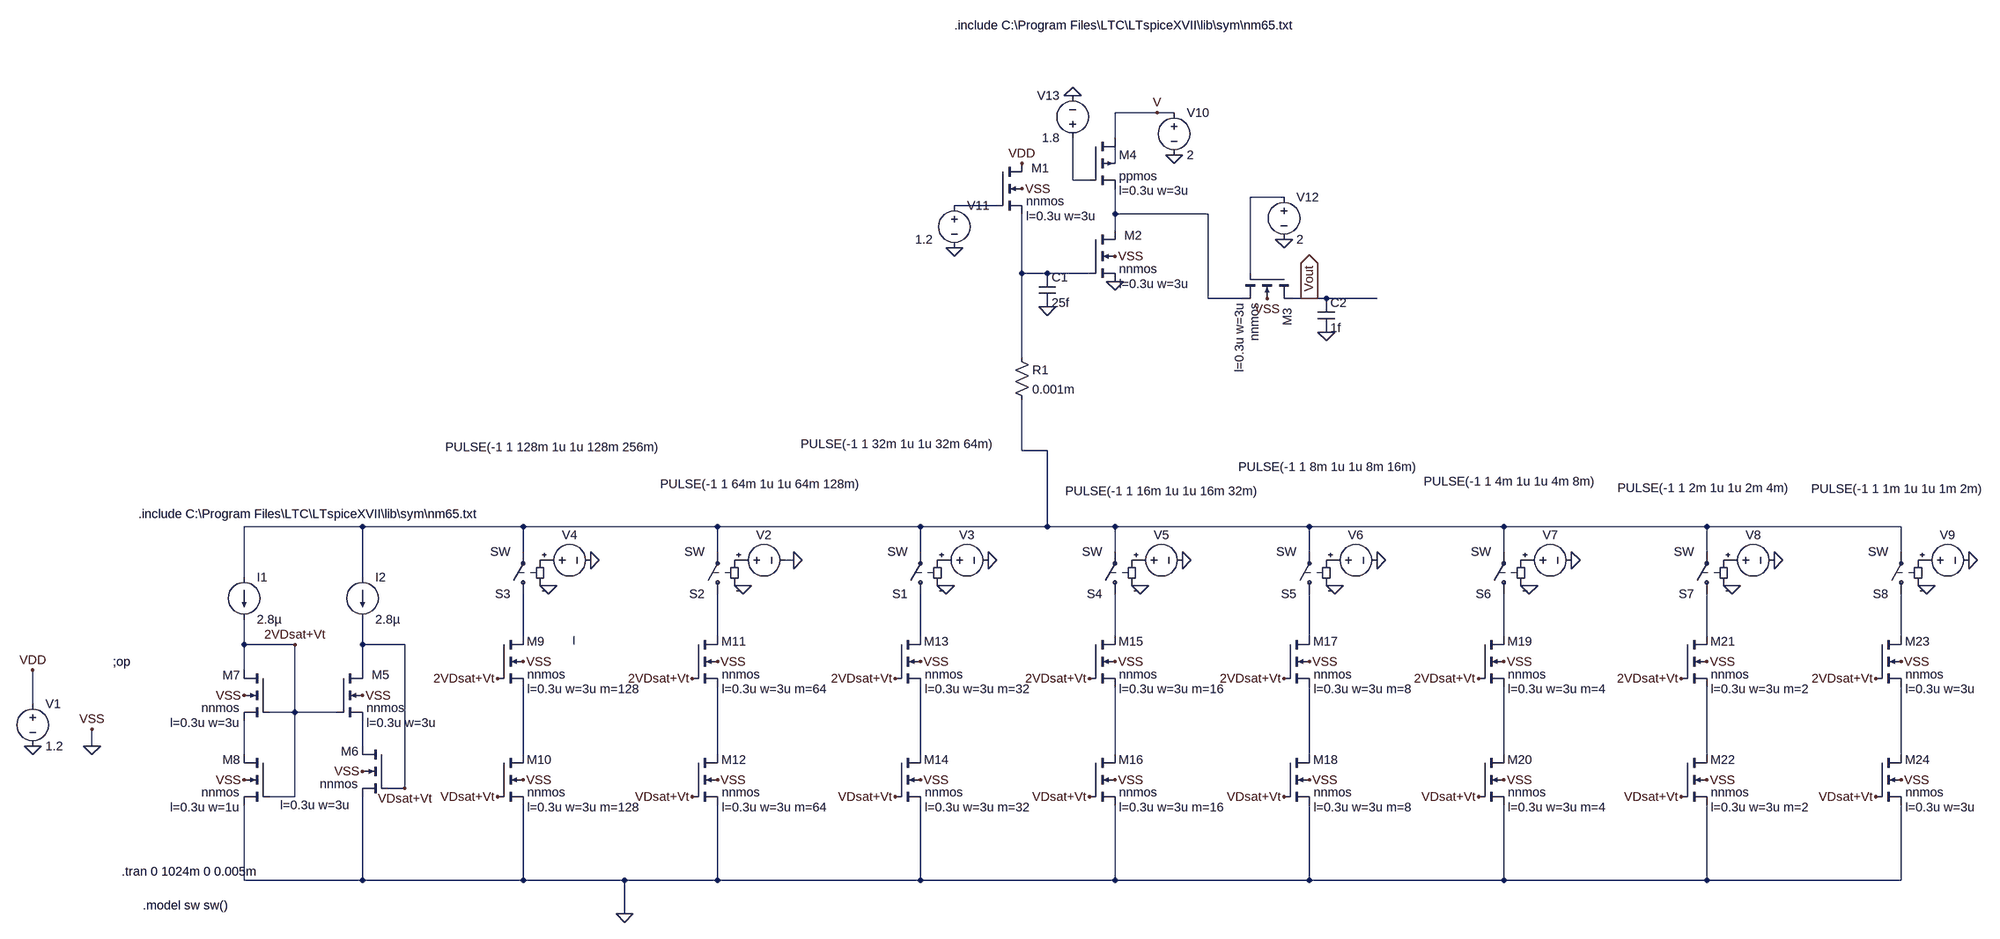
[diagram p0: schematic APS_cell_region_find_with_DAC.asc]
APS_cell_region_find_with_DAC.asc, the LTspice schematic file:
Version 4
SHEET 1 1800 1524
WIRE 224 -64 144 -64
WIRE 256 -64 224 -64
WIRE 144 -16 144 -64
WIRE 144 32 144 0
WIRE 64 64 64 -16
WIRE 96 64 64 64
WIRE 464 96 400 96
WIRE -80 112 -160 112
WIRE 144 128 144 80
WIRE 320 128 144 128
WIRE 144 160 144 128
WIRE -32 240 -32 128
WIRE 16 240 -32 240
WIRE 96 240 16 240
WIRE 400 240 400 96
WIRE 320 288 320 128
WIRE 384 288 320 288
WIRE 512 288 480 288
WIRE 544 288 512 288
WIRE 640 288 544 288
WIRE -32 400 -32 240
WIRE -32 576 -32 480
WIRE 16 576 -32 576
WIRE -1280 720 -1504 720
WIRE -976 720 -1280 720
WIRE -608 720 -976 720
WIRE -224 720 -608 720
WIRE 16 720 16 576
WIRE 16 720 -224 720
WIRE 144 720 16 720
WIRE 512 720 144 720
WIRE 880 720 512 720
WIRE 1264 720 880 720
WIRE 1632 720 1264 720
WIRE -976 768 -976 720
WIRE -608 768 -608 720
WIRE -224 768 -224 720
WIRE 144 768 144 720
WIRE 512 768 512 720
WIRE 880 768 880 720
WIRE 1264 768 1264 720
WIRE 1632 768 1632 720
WIRE -464 784 -480 784
WIRE -1504 816 -1504 720
WIRE -1280 816 -1280 720
WIRE -976 928 -976 848
WIRE -608 928 -608 848
WIRE -224 928 -224 848
WIRE 144 928 144 848
WIRE 512 928 512 848
WIRE 880 928 880 848
WIRE 1264 928 1264 848
WIRE 1632 928 1632 848
WIRE -1504 944 -1504 896
WIRE -1408 944 -1504 944
WIRE -1280 944 -1280 896
WIRE -1200 944 -1280 944
WIRE -880 944 -880 928
WIRE -1504 992 -1504 944
WIRE -1280 992 -1280 944
WIRE -1904 1056 -1904 992
WIRE -1408 1072 -1408 944
WIRE -1408 1072 -1456 1072
WIRE -1328 1072 -1408 1072
WIRE -1792 1136 -1792 1104
WIRE -1280 1136 -1280 1088
WIRE -1504 1152 -1504 1088
WIRE -976 1152 -976 1024
WIRE -608 1152 -608 1024
WIRE -224 1152 -224 1024
WIRE 144 1152 144 1024
WIRE 512 1152 512 1024
WIRE 880 1152 880 1024
WIRE 1264 1152 1264 1024
WIRE 1632 1152 1632 1024
WIRE -1200 1216 -1200 944
WIRE -1200 1216 -1232 1216
WIRE -1408 1232 -1408 1072
WIRE -1408 1232 -1456 1232
WIRE -1504 1440 -1504 1248
WIRE -1280 1440 -1280 1232
WIRE -1280 1440 -1504 1440
WIRE -976 1440 -976 1248
WIRE -976 1440 -1280 1440
WIRE -784 1440 -976 1440
WIRE -608 1440 -608 1248
WIRE -608 1440 -784 1440
WIRE -224 1440 -224 1248
WIRE -224 1440 -608 1440
WIRE 144 1440 144 1248
WIRE 144 1440 -224 1440
WIRE 512 1440 512 1248
WIRE 512 1440 144 1440
WIRE 880 1440 880 1248
WIRE 880 1440 512 1440
WIRE 1264 1440 1264 1248
WIRE 1264 1440 880 1440
WIRE 1632 1440 1632 1248
WIRE 1632 1440 1264 1440
WIRE -784 1504 -784 1440
FLAG -32 80 VSS
FLAG 144 208 VSS
FLAG 432 288 VSS
FLAG 16 304 0
FLAG -1792 1136 0
FLAG -1280 1040 VSS
FLAG -1280 1184 VSS
FLAG -1504 1040 VSS
FLAG -1504 1200 VSS
FLAG -976 976 VSS
FLAG -976 1200 VSS
FLAG -1792 1104 VSS
FLAG -1408 944 2VDsat+Vt
FLAG -1024 1008 2VDsat+Vt
FLAG -1200 1216 VDsat+Vt
FLAG -1904 1136 0
FLAG -1904 992 VDD
FLAG -608 976 VSS
FLAG -608 1200 VSS
FLAG -656 1008 2VDsat+Vt
FLAG -224 976 VSS
FLAG -224 1200 VSS
FLAG -272 1008 2VDsat+Vt
FLAG -656 1232 VDsat+Vt
FLAG -272 1232 VDsat+Vt
FLAG -848 784 0
FLAG -464 784 0
FLAG -96 784 0
FLAG -1024 1232 VDsat+Vt
FLAG -928 832 0
FLAG -560 832 0
FLAG -176 832 0
FLAG 144 976 VSS
FLAG 144 1200 VSS
FLAG 96 1008 2VDsat+Vt
FLAG 96 1232 VDsat+Vt
FLAG 272 784 0
FLAG 192 832 0
FLAG 512 976 VSS
FLAG 512 1200 VSS
FLAG 464 1008 2VDsat+Vt
FLAG 464 1232 VDsat+Vt
FLAG 640 784 0
FLAG 560 832 0
FLAG 880 976 VSS
FLAG 880 1200 VSS
FLAG 832 1008 2VDsat+Vt
FLAG 832 1232 VDsat+Vt
FLAG 1008 784 0
FLAG 928 832 0
FLAG 1264 976 VSS
FLAG 1264 1200 VSS
FLAG 1216 1008 2VDsat+Vt
FLAG 1216 1232 VDsat+Vt
FLAG 1392 784 0
FLAG 1312 832 0
FLAG 1632 976 VSS
FLAG 1632 1200 VSS
FLAG 1584 1008 2VDsat+Vt
FLAG 1584 1232 VDsat+Vt
FLAG 1760 784 0
FLAG 1680 832 0
FLAG -784 1504 0
FLAG 544 352 0
FLAG 512 288 Vout
IOPIN 512 288 Out
FLAG 256 16 0
FLAG 144 256 0
FLAG 224 -64 V
FLAG -32 32 VDD
FLAG -160 192 0
FLAG 464 176 0
FLAG 64 -96 0
SYMBOL nmos4 -80 32 R0
WINDOW 123 56 100 Left 2
WINDOW 0 66 9 Left 2
SYMATTR Value2 l=0.3u w=3u
SYMATTR InstName M1
SYMATTR Value nnmos
SYMBOL nmos4 96 160 R0
WINDOW 123 56 100 Left 2
WINDOW 0 66 9 Left 2
SYMATTR Value2 l=0.3u w=3u
SYMATTR InstName M2
SYMATTR Value nnmos
SYMBOL nmos4 480 240 R90
WINDOW 123 56 100 Left 2
WINDOW 0 66 9 Left 2
SYMATTR Value2 l=0.3u w=3u
SYMATTR InstName M3
SYMATTR Value nnmos
SYMBOL pmos4 96 -16 R0
WINDOW 123 56 100 Left 2
SYMATTR Value2 l=0.3u w=3u
SYMATTR InstName M4
SYMATTR Value ppmos
SYMBOL cap 0 240 R0
SYMATTR InstName C1
SYMATTR Value 25f
SYMBOL nmos4 -1328 992 R0
WINDOW 123 56 100 Left 2
WINDOW 0 66 9 Left 2
SYMATTR Value2 l=0.3u w=3u
SYMATTR InstName M5
SYMATTR Value nnmos
SYMBOL nmos4 -1232 1136 M0
WINDOW 123 72 112 Left 2
WINDOW 0 55 10 Left 2
SYMATTR Value2 l=0.3u w=3u
SYMATTR InstName M6
SYMATTR Value nnmos
SYMBOL nmos4 -1456 992 M0
WINDOW 123 56 100 Left 2
WINDOW 0 55 10 Left 2
SYMATTR Value2 l=0.3u w=3u
SYMATTR InstName M7
SYMATTR Value nnmos
SYMBOL nmos4 -1456 1152 M0
WINDOW 123 56 100 Left 2
WINDOW 0 55 10 Left 2
SYMATTR Value2 l=0.3u w=1u
SYMATTR InstName M8
SYMATTR Value nnmos
SYMBOL nmos4 -1024 928 R0
WINDOW 123 56 100 Left 2
WINDOW 0 55 10 Left 2
SYMATTR Value2 l=0.3u w=3u m=128
SYMATTR InstName M9
SYMATTR Value nnmos
SYMBOL nmos4 -1024 1152 R0
WINDOW 123 56 100 Left 2
WINDOW 0 55 10 Left 2
SYMATTR Value2 l=0.3u w=3u m=128
SYMATTR InstName M10
SYMATTR Value nnmos
SYMBOL current -1504 816 R0
WINDOW 123 0 0 Left 0
WINDOW 39 0 0 Left 0
SYMATTR InstName I1
SYMATTR Value 2.8µ
SYMBOL current -1280 816 R0
WINDOW 123 0 0 Left 0
WINDOW 39 0 0 Left 0
SYMATTR InstName I2
SYMATTR Value 2.8µ
SYMBOL voltage -1904 1040 R0
WINDOW 123 0 0 Left 0
WINDOW 39 0 0 Left 0
SYMATTR InstName V1
SYMATTR Value 1.2
SYMBOL nmos4 -656 928 R0
WINDOW 123 56 100 Left 2
WINDOW 0 55 10 Left 2
SYMATTR Value2 l=0.3u w=3u m=64
SYMATTR InstName M11
SYMATTR Value nnmos
SYMBOL nmos4 -656 1152 R0
WINDOW 123 56 100 Left 2
WINDOW 0 55 10 Left 2
SYMATTR Value2 l=0.3u w=3u m=64
SYMATTR InstName M12
SYMATTR Value nnmos
SYMBOL nmos4 -272 928 R0
WINDOW 123 56 100 Left 2
WINDOW 0 55 10 Left 2
SYMATTR Value2 l=0.3u w=3u m=32
SYMATTR InstName M13
SYMATTR Value nnmos
SYMBOL nmos4 -272 1152 R0
WINDOW 123 56 100 Left 2
WINDOW 0 55 10 Left 2
SYMATTR Value2 l=0.3u w=3u m=32
SYMATTR InstName M14
SYMATTR Value nnmos
SYMBOL voltage -576 784 M90
WINDOW 0 -32 56 VBottom 2
WINDOW 3 -160 49 VTop 2
WINDOW 123 0 0 Left 0
WINDOW 39 0 0 Left 0
SYMATTR InstName V2
SYMATTR Value PULSE(-1 1 64m 1u 1u 64m 128m)
SYMBOL voltage -192 784 M90
WINDOW 0 -32 56 VBottom 2
WINDOW 3 -236 -76 VTop 2
WINDOW 123 0 0 Left 0
WINDOW 39 0 0 Left 0
SYMATTR InstName V3
SYMATTR Value PULSE(-1 1 32m 1u 1u 32m 64m)
SYMBOL voltage -944 784 M90
WINDOW 0 -32 56 VBottom 2
WINDOW 3 -230 24 VTop 2
WINDOW 123 0 0 Left 0
WINDOW 39 0 0 Left 0
SYMATTR InstName V4
SYMATTR Value PULSE(-1 1 128m 1u 1u 128m 256m)
SYMBOL sw -224 864 R180
SYMATTR InstName S1
SYMBOL sw -608 864 R180
SYMATTR InstName S2
SYMBOL sw -976 864 R180
SYMATTR InstName S3
SYMBOL nmos4 96 928 R0
WINDOW 123 56 100 Left 2
WINDOW 0 55 10 Left 2
SYMATTR Value2 l=0.3u w=3u m=16
SYMATTR InstName M15
SYMATTR Value nnmos
SYMBOL nmos4 96 1152 R0
WINDOW 123 56 100 Left 2
WINDOW 0 55 10 Left 2
SYMATTR Value2 l=0.3u w=3u m=16
SYMATTR InstName M16
SYMATTR Value nnmos
SYMBOL voltage 176 784 M90
WINDOW 0 -32 56 VBottom 2
WINDOW 3 -147 57 VTop 2
WINDOW 123 0 0 Left 0
WINDOW 39 0 0 Left 0
SYMATTR InstName V5
SYMATTR Value PULSE(-1 1 16m 1u 1u 16m 32m)
SYMBOL sw 144 864 R180
SYMATTR InstName S4
SYMBOL nmos4 464 928 R0
WINDOW 123 56 100 Left 2
WINDOW 0 55 10 Left 2
SYMATTR Value2 l=0.3u w=3u m=8
SYMATTR InstName M17
SYMATTR Value nnmos
SYMBOL nmos4 464 1152 R0
WINDOW 123 56 100 Left 2
WINDOW 0 55 10 Left 2
SYMATTR Value2 l=0.3u w=3u m=8
SYMATTR InstName M18
SYMATTR Value nnmos
SYMBOL voltage 544 784 M90
WINDOW 0 -32 56 VBottom 2
WINDOW 3 -193 3 VTop 2
WINDOW 123 0 0 Left 0
WINDOW 39 0 0 Left 0
SYMATTR InstName V6
SYMATTR Value PULSE(-1 1 8m 1u 1u 8m 16m)
SYMBOL sw 512 864 R180
SYMATTR InstName S5
SYMBOL nmos4 832 928 R0
WINDOW 123 56 100 Left 2
WINDOW 0 55 10 Left 2
SYMATTR Value2 l=0.3u w=3u m=4
SYMATTR InstName M19
SYMATTR Value nnmos
SYMBOL nmos4 832 1152 R0
WINDOW 123 56 100 Left 2
WINDOW 0 55 10 Left 2
SYMATTR Value2 l=0.3u w=3u m=4
SYMATTR InstName M20
SYMATTR Value nnmos
SYMBOL voltage 912 784 M90
WINDOW 0 -32 56 VBottom 2
WINDOW 3 -165 -21 VTop 2
WINDOW 123 0 0 Left 0
WINDOW 39 0 0 Left 0
SYMATTR InstName V7
SYMATTR Value PULSE(-1 1 4m 1u 1u 4m 8m)
SYMBOL sw 880 864 R180
SYMATTR InstName S6
SYMBOL nmos4 1216 928 R0
WINDOW 123 56 100 Left 2
WINDOW 0 55 10 Left 2
SYMATTR Value2 l=0.3u w=3u m=2
SYMATTR InstName M21
SYMATTR Value nnmos
SYMBOL nmos4 1216 1152 R0
WINDOW 123 56 100 Left 2
WINDOW 0 55 10 Left 2
SYMATTR Value2 l=0.3u w=3u m=2
SYMATTR InstName M22
SYMATTR Value nnmos
SYMBOL voltage 1296 784 M90
WINDOW 0 -32 56 VBottom 2
WINDOW 3 -153 -38 VTop 2
WINDOW 123 0 0 Left 0
WINDOW 39 0 0 Left 0
SYMATTR InstName V8
SYMATTR Value PULSE(-1 1 2m 1u 1u 2m 4m)
SYMBOL sw 1264 864 R180
SYMATTR InstName S7
SYMBOL nmos4 1584 928 R0
WINDOW 123 56 100 Left 2
WINDOW 0 55 10 Left 2
SYMATTR Value2 l=0.3u w=3u
SYMATTR InstName M23
SYMATTR Value nnmos
SYMBOL nmos4 1584 1152 R0
WINDOW 123 56 100 Left 2
WINDOW 0 55 10 Left 2
SYMATTR Value2 l=0.3u w=3u
SYMATTR InstName M24
SYMATTR Value nnmos
SYMBOL voltage 1664 784 M90
WINDOW 0 -32 56 VBottom 2
WINDOW 3 -151 -39 VTop 2
WINDOW 123 0 0 Left 0
WINDOW 39 0 0 Left 0
SYMATTR InstName V9
SYMATTR Value PULSE(-1 1 1m 1u 1u 1m 2m)
SYMBOL sw 1632 864 R180
SYMATTR InstName S8
SYMBOL cap 528 288 R0
SYMATTR InstName C2
SYMATTR Value 1f
SYMBOL voltage 256 -80 R0
WINDOW 123 0 0 Left 0
WINDOW 39 0 0 Left 0
SYMATTR InstName V10
SYMATTR Value 2
SYMBOL voltage -160 96 R0
WINDOW 3 -74 80 Left 2
WINDOW 123 0 0 Left 0
WINDOW 39 0 0 Left 0
SYMATTR Value 1.2
SYMATTR InstName V11
SYMBOL voltage 464 80 R0
WINDOW 123 0 0 Left 0
WINDOW 39 0 0 Left 0
SYMATTR InstName V12
SYMATTR Value 2
SYMBOL voltage 64 0 R180
WINDOW 0 24 96 Left 2
WINDOW 3 24 16 Left 2
WINDOW 123 0 0 Left 0
WINDOW 39 0 0 Left 0
SYMATTR InstName V13
SYMATTR Value 1.8
SYMBOL res -48 384 R0
SYMATTR InstName R1
SYMATTR Value 0.001m
TEXT -160 -240 Left 2 !.include C:\\Program Files\\LTC\\LTspiceXVII\\lib\\sym\\nm65.txt
TEXT -1704 696 Left 2 !.include C:\\Program Files\\LTC\\LTspiceXVII\\lib\\sym\\nm65.txt
TEXT -1752 976 Left 2 !;op
TEXT -1736 1424 Left 2 !.tran 0 1024m 0 0.005m
TEXT -1696 1488 Left 2 !.model sw sw()

The netlist it stands for:
* APS_cell_region_find_with_DAC.asc
M1 VDD N004 N006 0 nnmos l=0.3u w=3u
M2 N005 N006 0 0 nnmos l=0.3u w=3u
M3 Vout N003 N005 0 nnmos l=0.3u w=3u
M4 V N002 N005 N001 ppmos l=0.3u w=3u
C1 N006 0 25f
M5 VDsat+Vt 2VDsat+Vt N017 0 nnmos l=0.3u w=3u
M6 N017 VDsat+Vt 0 0 nnmos l=0.3u w=3u
M7 2VDsat+Vt 2VDsat+Vt N018 0 nnmos l=0.3u w=3u
M8 N018 2VDsat+Vt 0 0 nnmos l=0.3u w=1u
M9 N008 2VDsat+Vt N019 0 nnmos l=0.3u w=3u m=128
M10 N019 VDsat+Vt 0 0 nnmos l=0.3u w=3u m=128
I1 N007 2VDsat+Vt 2.8µ
I2 N007 VDsat+Vt 2.8µ
V1 VDD 0 1.2
M11 N009 2VDsat+Vt N020 0 nnmos l=0.3u w=3u m=64
M12 N020 VDsat+Vt 0 0 nnmos l=0.3u w=3u m=64
M13 N010 2VDsat+Vt N021 0 nnmos l=0.3u w=3u m=32
M14 N021 VDsat+Vt 0 0 nnmos l=0.3u w=3u m=32
V2 P001 0 PULSE(-1 1 64m 1u 1u 64m 128m)
V3 P002 0 PULSE(-1 1 32m 1u 1u 32m 64m)
V4 P003 0 PULSE(-1 1 128m 1u 1u 128m 256m)
S1 N010 N007 P002 0 SW
S2 N009 N007 P001 0 SW
S3 N008 N007 P003 0 SW
M15 N011 2VDsat+Vt N022 0 nnmos l=0.3u w=3u m=16
M16 N022 VDsat+Vt 0 0 nnmos l=0.3u w=3u m=16
V5 P004 0 PULSE(-1 1 16m 1u 1u 16m 32m)
S4 N011 N007 P004 0 SW
M17 N012 2VDsat+Vt N023 0 nnmos l=0.3u w=3u m=8
M18 N023 VDsat+Vt 0 0 nnmos l=0.3u w=3u m=8
V6 P005 0 PULSE(-1 1 8m 1u 1u 8m 16m)
S5 N012 N007 P005 0 SW
M19 N013 2VDsat+Vt N024 0 nnmos l=0.3u w=3u m=4
M20 N024 VDsat+Vt 0 0 nnmos l=0.3u w=3u m=4
V7 P006 0 PULSE(-1 1 4m 1u 1u 4m 8m)
S6 N013 N007 P006 0 SW
M21 N014 2VDsat+Vt N025 0 nnmos l=0.3u w=3u m=2
M22 N025 VDsat+Vt 0 0 nnmos l=0.3u w=3u m=2
V8 P007 0 PULSE(-1 1 2m 1u 1u 2m 4m)
S7 N014 N007 P007 0 SW
M23 N015 2VDsat+Vt N026 0 nnmos l=0.3u w=3u
M24 N026 VDsat+Vt 0 0 nnmos l=0.3u w=3u
V9 P008 0 PULSE(-1 1 1m 1u 1u 1m 2m)
S8 N015 N007 P008 0 SW
C2 Vout 0 1f
V10 V 0 2
V11 N004 0 1.2
V12 N003 0 2
V13 N002 0 1.8
R1 N006 N007 0.001m
.model NMOS NMOS
.model PMOS PMOS
.lib standard.mos
.include C:\Program Files\LTC\LTspiceXVII\lib\sym\nm65.txt
.include C:\Program Files\LTC\LTspiceXVII\lib\sym\nm65.txt
;op
.tran 0 1024m 0 0.005m
.model sw sw()
.backanno
.end